# EasyEDA schematic SCH_Konwerter-Hal-Elektrody_2026-02-04.json
TITLE: Hal-Electrode converter; REV: 1.0; Date: 2026-01-30; Sheet: 1/1; Drawn By: dom78kow; Company: Your Company
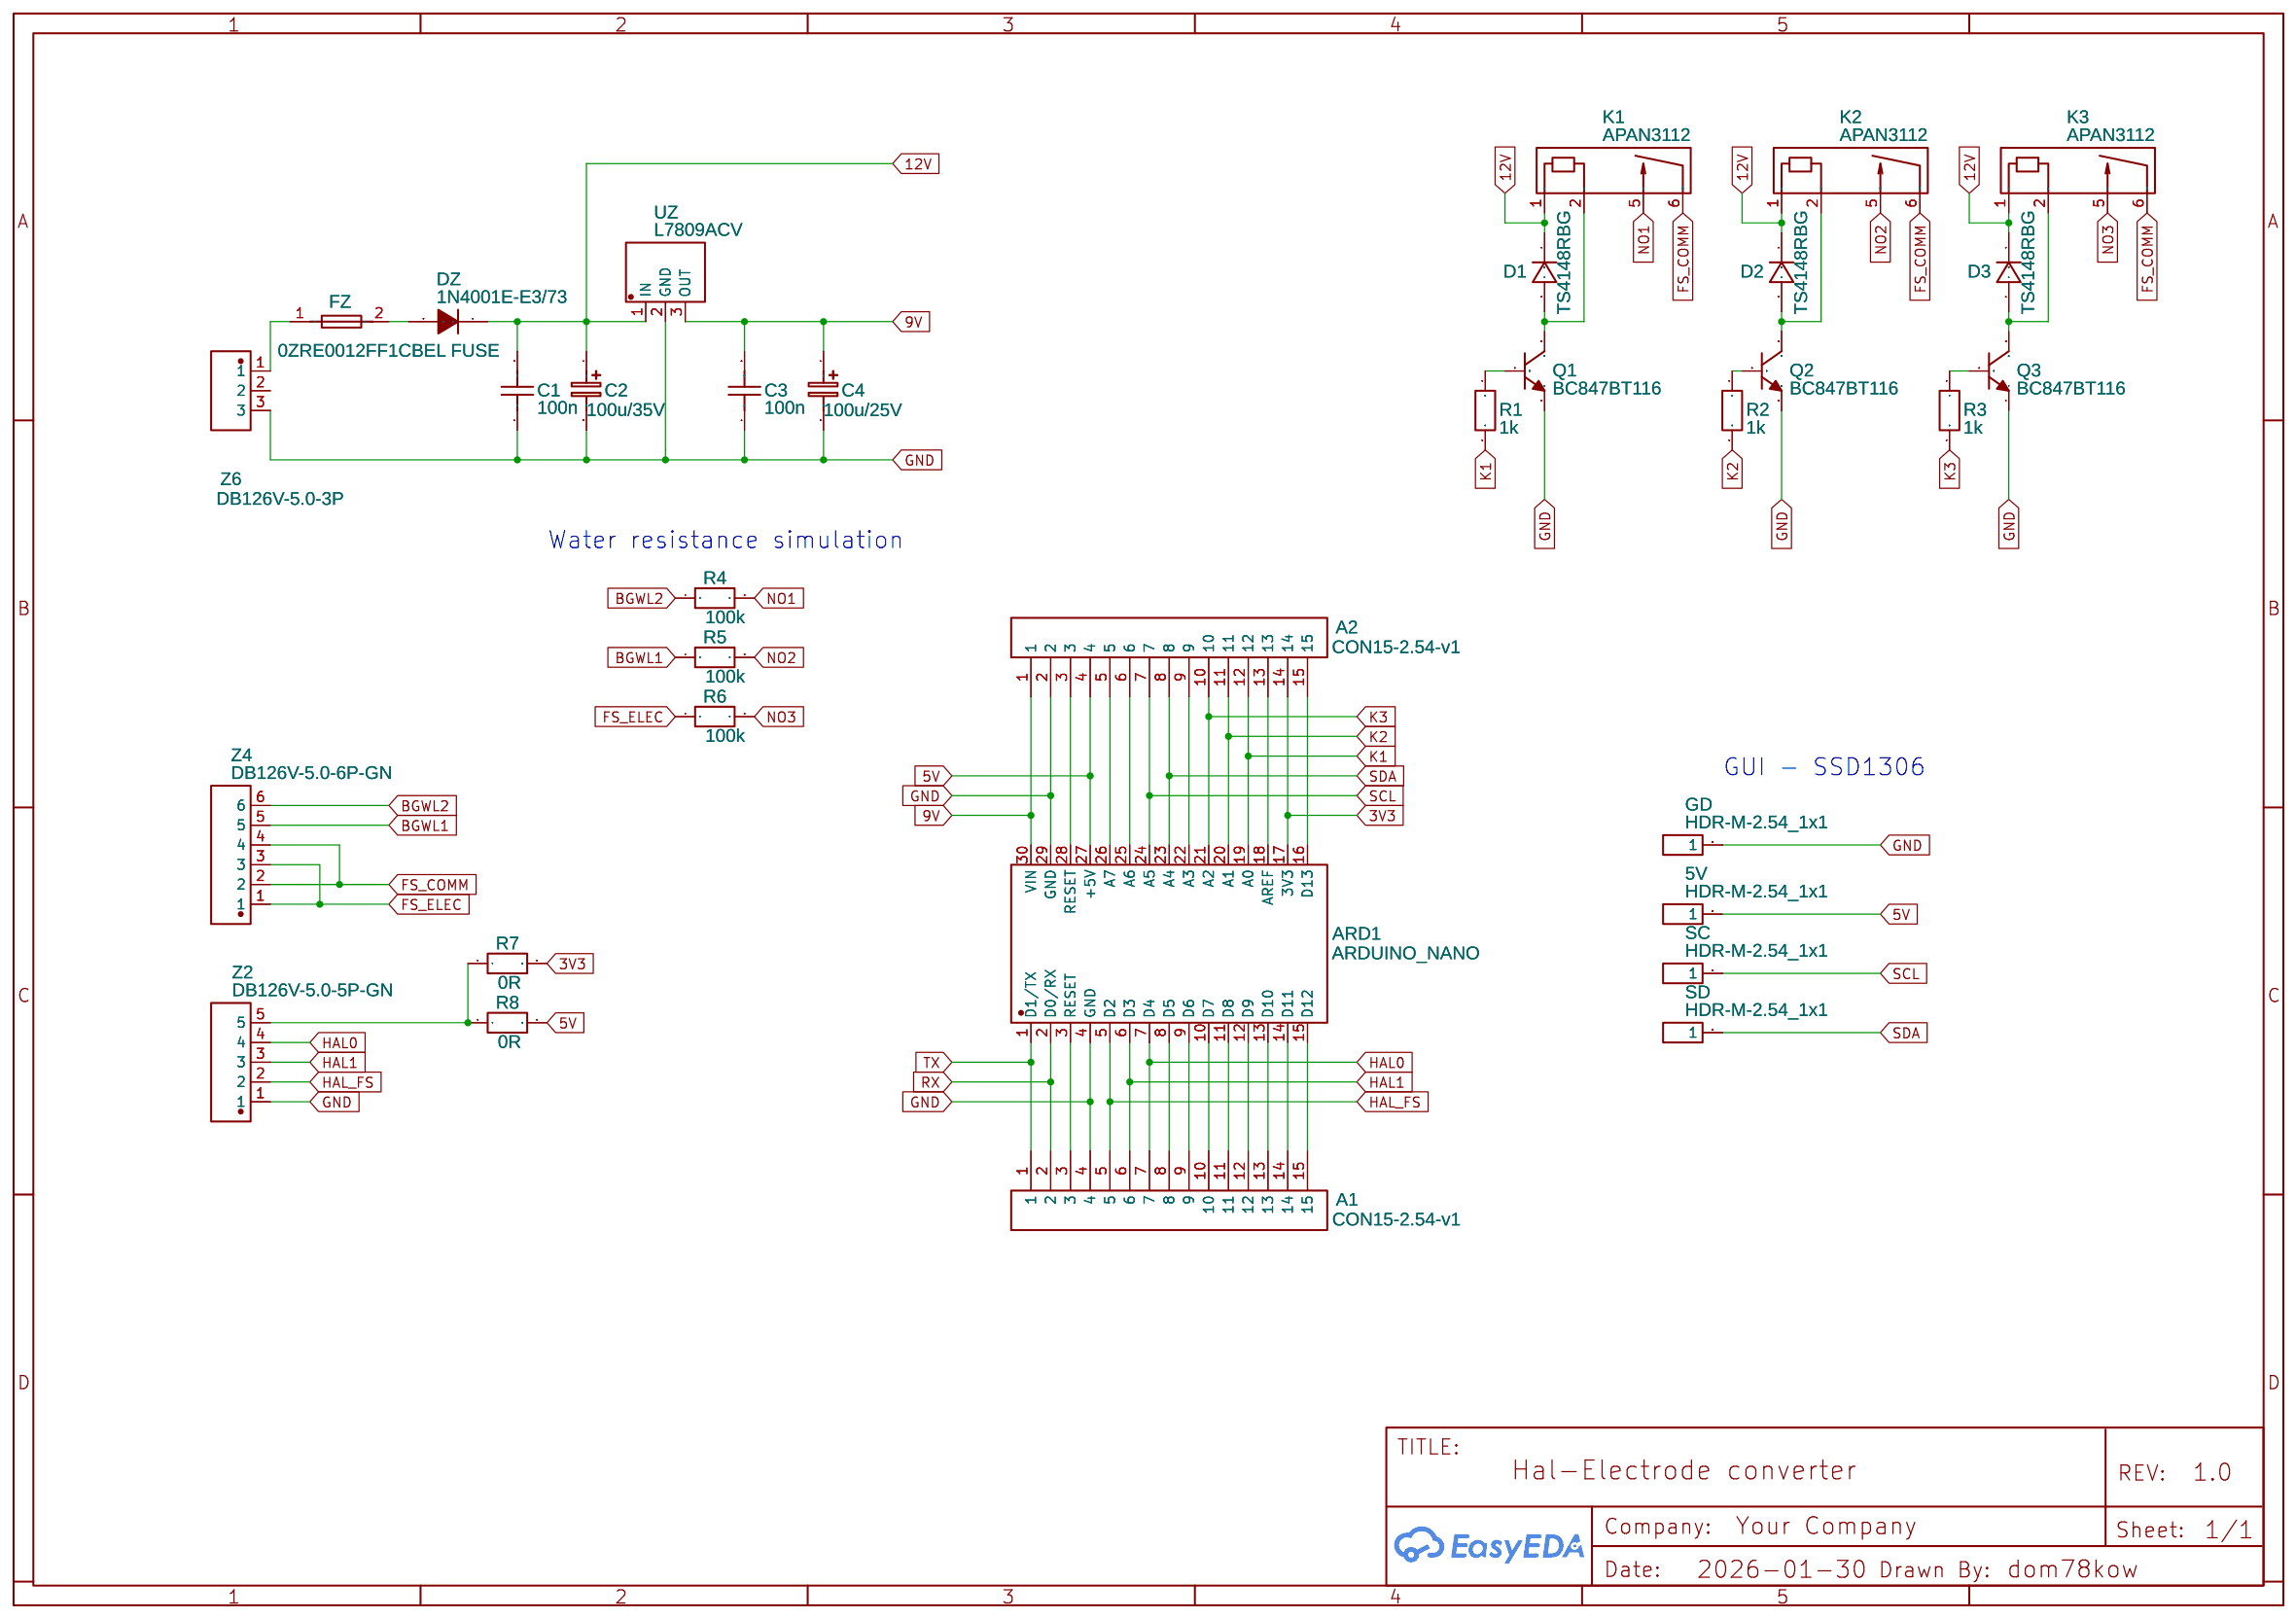
[diagram p0: schematic sheet]

## Parts
5V  HDR-M-2.54_1x1  [HDR-M-2.54_1X1]
A1  CON15-2.54-v1  [CON15-2.54-V1]
A2  CON15-2.54-v1  [CON15-2.54-V1]
ARD1  ARDUINO_NANO  [COMM-TH_ARDUINO_NANO]
C1  100n  [C1206]
C2  100u/35V  [CAP-D5.0×F2.0]
C3  100n  [C1206]
C4  100u/25V  [CAP-D5.0×F2.0]
D1  TS4148RBG  [D1206-RD]
D2  TS4148RBG  [D1206-RD]
D3  TS4148RBG  [D1206-RD]
DZ  1N4001E-E3/73  [DO-41_BD2.4-L4.7-P8.70-D0.8-RD]
FZ  0ZRE0012FF1CBEL FUSE  [FUSE-TH_L8.5-W4.0-P5.08-D0.6]
GD  HDR-M-2.54_1x1  [HDR-M-2.54_1X1]
K1  APAN3112  [RELAY-TH_PANASONIC_APAN31XX]
K2  APAN3112  [RELAY-TH_PANASONIC_APAN31XX]
K3  APAN3112  [RELAY-TH_PANASONIC_APAN31XX]
Q1  BC847BT116  [SOT-23-3_L2.9-W1.3-P1.90-LS2.4-BR-2]
Q2  BC847BT116  [SOT-23-3_L2.9-W1.3-P1.90-LS2.4-BR-2]
Q3  BC847BT116  [SOT-23-3_L2.9-W1.3-P1.90-LS2.4-BR-2]
R1  1k  [R1206]
R2  1k  [R1206]
R3  1k  [R1206]
R4  100k  [R1206]
R5  100k  [R1206]
R6  100k  [R1206]
R7  0R  [R1206]
R8  0R  [R1206]
SC  HDR-M-2.54_1x1  [HDR-M-2.54_1X1]
SD  HDR-M-2.54_1x1  [HDR-M-2.54_1X1]
UZ  L7809ACV  [TO-220-3_L10.0-W4.5-P2.54-T]
Z2  DB126V-5.0-5P-GN  [CONN-TH_5P-P5.00-L8.0-W25.0]
Z4  DB126V-5.0-6P-GN  [CONN-TH_DB126V-5.0-6P-GN]
Z6  DB126V-5.0-3P  [CONN-TH_3P-P5.00_DB126V-5.0-3P]

## Library data of the parts
5V GD SC SD = HDR-M-2.54_1x1: Supplier Part: C81276; Supplier: LCSC; Contributor: LCEDA_Lib
A1 A2 = CON15-2.54-v1: Contributor: Felipe Jose
ARD1 = ARDUINO_NANO: Contributor: lcsc; Supplier: LCSC; Supplier Part: C9900017879; Manufacturer: null; JLCPCB Part Class: Extended Part
C1 C3 = C_1206_US: Contributor: LCEDA_Lib
C2 C4 = CE_TH_D5.0×F2.0_EU: Contributor: LCEDA_Lib
D1-D3 = CD4148WP_C112371: Supplier: LCSC; Supplier Part: C112371; Manufacturer: SUP(美隆); Manufacturer Part: CD4148WP; Contributor: LCSC; JLCPCB Part Class: Extended Part
DZ = 1N4001E-E3/73: Supplier: LCSC; Supplier Part: C26137025; Manufacturer: VISHAY(威世); Contributor: lcsc
FZ = SCT 2.5A: Supplier: LCSC; Supplier Part: C669449; Manufacturer: Skygate(天宇匹克); Contributor: LCSC; JLCPCB Part Class: Extended Part
K1-K3 = APAN3105: Supplier: LCSC; Manufacturer: PANASONIC(松下); Supplier Part: C90227; JLCPCB Part Class: Extended Part
Q1-Q3 = BC847BT116: Supplier: LCSC; Supplier Part: C5336648; Manufacturer: ROHM(罗姆); link: https://atta.szlcsc.com/upload/public/pdf/source/20221223/23445BA4B5DF89FBAA9419DC462BB0E7.pdf; Contributor: lcsc
R1-R8 = R_1206_EU: Contributor: LCEDA_Lib
UZ = L7812ACV: Contributor: LCSC; Supplier: LCSC; Supplier Part: C193763; Manufacturer: ST(意法半导体); JLCPCB Part Class: Extended Part
Z2 = DB126V-5.0-5P-GN: Contributor: LCSC; Supplier: LCSC; Supplier Part: C2835160; Manufacturer: DIBO(地博电气); Manufacturer Part: DB126V-5.0-5P-GN-P; JLCPCB Part Class: Extended Part
Z4 = DB126V-5.0-6P-GN: Contributor: LCSC; Supplier: LCSC; Supplier Part: C2682301; Manufacturer: DORABO(地博电气); Manufacturer Part: DB126V-5.0-6P-GN-P; JLCPCB Part Class: Extended Part
Z6 = DB126V-5.0-3P: Contributor: LCSC; Supplier: LCSC; Supplier Part: C395850; Manufacturer: DORABO(地博电气); Manufacturer Part: DB126V-5.0-3P-GN; JLCPCB Part Class: Extended Part

## Nets
3V3: A2.14 ARD1.17(3V3) R7.2
5V: 5V.1 A2.4 ARD1.27(+5V) R8.2
9V: A2.1 ARD1.30(VIN) C3.2 C4.1 UZ.3(OUT)
12V: C1.2 C2.1 D1.1(C) D2.1(C) D3.1(C) DZ.1(K) K1.1 K2.1 K3.1 UZ.1(IN)
GND: A1.4 A2.2 ARD1.4(GND) ARD1.29(GND) C1.1 C2.2 C3.1 C4.2 GD.1 Q1.1(E) Q2.1(E) Q3.1(E) UZ.2(GND) Z2.1 Z6.3
BGWL1: R5.1 Z4.5
BGWL2: R4.1 Z4.6
FS_COMM: K1.6(COM) K2.6(COM) K3.6(COM) Z4.2 Z4.4
FS_ELEC: R6.1 Z4.1 Z4.3
HAL0: A1.7 ARD1.7(D4) Z2.4
HAL1: A1.6 ARD1.6(D3) Z2.3
HAL_FS: A1.5 ARD1.5(D2) Z2.2
K1: A2.12 ARD1.19(A0) R1.2
K2: A2.11 ARD1.20(A1) R2.2
K3: A2.10 ARD1.21(A2) R3.2
NO1: K1.5(ON) R4.2
NO2: K2.5(ON) R5.2
NO3: K3.5(ON) R6.2
RX: A1.2 ARD1.2(D0/RX)
SCL: A2.7 ARD1.24(A5) SC.1
SDA: A2.8 ARD1.23(A4) SD.1
TX: A1.1 ARD1.1(D1/TX)
Net-(A1-3): A1.3 ARD1.3(RESET)
Net-(A1-8): A1.8 ARD1.8(D5)
Net-(A1-9): A1.9 ARD1.9(D6)
Net-(A1-10): A1.10 ARD1.10(D7)
Net-(A1-11): A1.11 ARD1.11(D8)
Net-(A1-12): A1.12 ARD1.12(D9)
Net-(A1-13): A1.13 ARD1.13(D10)
Net-(A1-14): A1.14 ARD1.14(D11)
Net-(A1-15): A1.15 ARD1.15(D12)
Net-(A2-3): A2.3 ARD1.28(RESET)
Net-(A2-5): A2.5 ARD1.26(A7)
Net-(A2-6): A2.6 ARD1.25(A6)
Net-(A2-9): A2.9 ARD1.22(A3)
Net-(A2-13): A2.13 ARD1.18(AREF)
Net-(A2-15): A2.15 ARD1.16(D13)
Net-(D1-2): D1.2(A) K1.2 Q1.3(C)
Net-(D2-2): D2.2(A) K2.2 Q2.3(C)
Net-(D3-2): D3.2(A) K3.2 Q3.3(C)
Net-(DZ-2): DZ.2(A) FZ.2
Net-(FZ-1): FZ.1 Z6.1
Net-(Q1-2): Q1.2(B) R1.1
Net-(Q2-2): Q2.2(B) R2.1
Net-(Q3-2): Q3.2(B) R3.1
Net-(R7-1): R7.1 R8.1 Z2.5

Not connected (* = marked no-connect by the designer): Z6 2

## Notes on the sheet
- Water resistance simulation
- GUI - SSD1306
